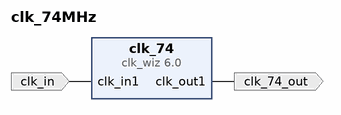
[diagram p0: block diagram of the top level]
# Vivado block design clk_74MHz, xc7z010clg400-1, Vivado 2018.2
create_bd_design clk_74MHz

create_bd_port -dir I -type clk clk_in
set_property -dict {CONFIG.FREQ_HZ 125000000} [get_bd_ports clk_in]
create_bd_port -dir O -type clk clk_74_out
set_property -dict {CONFIG.FREQ_HZ 74250000} [get_bd_ports clk_74_out]

create_bd_cell -type ip -vlnv xilinx.com:ip:clk_wiz:6.0 clk_74
set_property -dict [list \
  CONFIG.CLKOUT1_REQUESTED_OUT_FREQ 74.250 \
  CONFIG.USE_LOCKED false \
  CONFIG.USE_RESET false \
  CONFIG.MMCM_DIVCLK_DIVIDE 5 \
  CONFIG.MMCM_CLKFBOUT_MULT_F 37.125 \
  CONFIG.MMCM_CLKOUT0_DIVIDE_F 12.500 \
  CONFIG.CLKOUT1_JITTER 244.188 \
  CONFIG.CLKOUT1_PHASE_ERROR 245.344 \
] [get_bd_cells clk_74]

# ---- connections ----

connect_bd_net -net clk_in1_0_1 [get_bd_ports clk_in] [get_bd_pins clk_74/clk_in1]
connect_bd_net [get_bd_pins clk_74/clk_out1] [get_bd_ports clk_74_out]

validate_bd_design
save_bd_design
